# Altium schematic sheet SUP_1V.SchDoc: AMC FMC Carrier v4
size A4; CompanyName: WUT; Organization: WUT ISE; Address1: Warsaw Univeristy of Technology; Address2: Nowowiejska 15/19 00-665 Warsaw; Address3: t.przywozki@gmail.com; Revision: 1; SheetNumber: 14; SheetTotal: 29; Project: AMC FMC Carrier v4; ModifiedBy: -; CreateDate: XX/XX/XXXX; CheckedDate: -; Title2: Power P1V0; DivGrp: ISE; Designer: T. Przywozki; ModifiedDate: -; ProjectName: ADC/DAC MEZZANINE
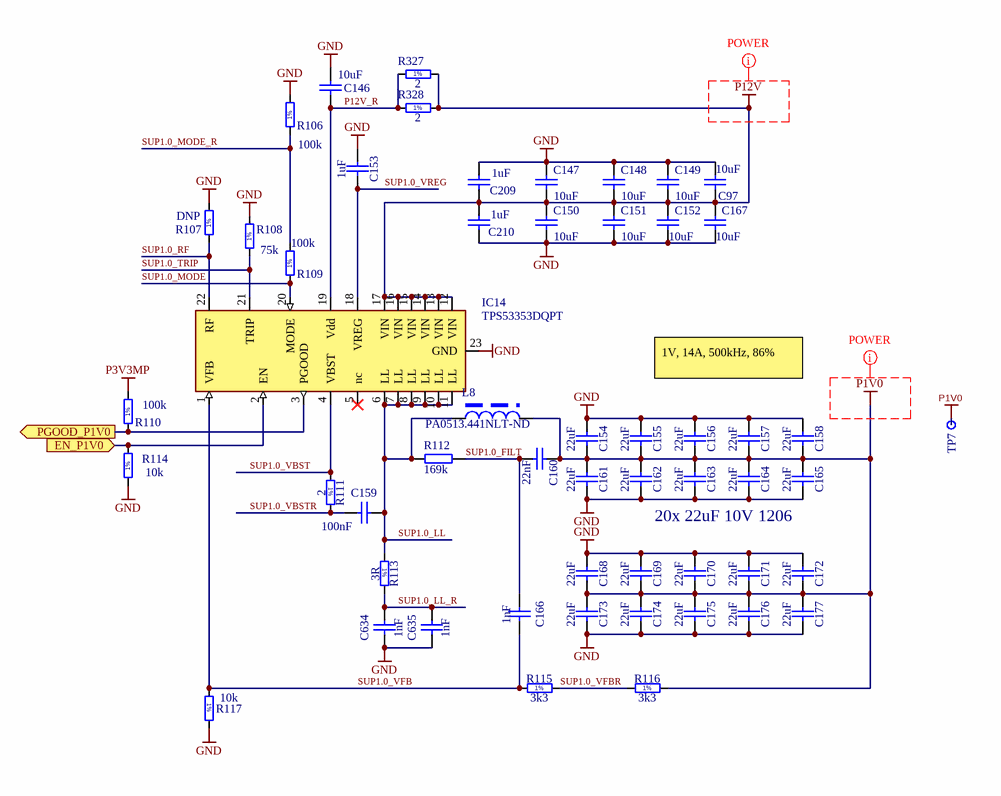
[diagram p0: SUP_1V.SchDoc]

## Parts
C97  10uF  [CAPC2012X135N]
C146  10uF  [CAPC2012X135N]
C147  10uF  [CAPC2012X135N]
C148  10uF  [CAPC2012X135N]
C149  10uF  [CAPC2012X135N]
C150  10uF  [CAPC2012X135N]
C151  10uF  [CAPC2012X135N]
C152  10uF  [CAPC2012X135N]
C153  1uF  [CAPC1608X87N]
C154  22uF  [CAPC3216X180N]
C155  22uF  [CAPC3216X180N]
C156  22uF  [CAPC3216X180N]
C157  22uF  [CAPC3216X180N]
C158  22uF  [CAPC3216X180N]
C159  100nF  [CAPC1005X55N]
C160  22nF  [CAPC1608X87N]
C161  22uF  [CAPC3216X180N]
C162  22uF  [CAPC3216X180N]
C163  22uF  [CAPC3216X180N]
C164  22uF  [CAPC3216X180N]
C165  22uF  [CAPC3216X180N]
C166  1nF  [CAPC1005X55N]
C167  10uF  [CAPC2012X135N]
C168  22uF  [CAPC3216X180N]
C169  22uF  [CAPC3216X180N]
C170  22uF  [CAPC3216X180N]
C171  22uF  [CAPC3216X180N]
C172  22uF  [CAPC3216X180N]
C173  22uF  [CAPC3216X180N]
C174  22uF  [CAPC3216X180N]
C175  22uF  [CAPC3216X180N]
C176  22uF  [CAPC3216X180N]
C177  22uF  [CAPC3216X180N]
C209  1uF  [CAPC1608X87N]
C210  1uF  [CAPC1608X87N]
C634  1nF  [CAPC1005X55N]
C635  1nF  [CAPC1005X55N]
IC14  TPS53353DQPT  [LCCS50P600X500X150-22N]
L8  PA0513.441NLT-ND  [IND_PA0513]
R106  100k  [RESC1005X40N]
R107  DNP  [RESC1608X55N]
R108  75k  [RESC1608X55N]
R109  100k  [RESC1005X40N]
R110  100k  [RESC1005X40N]
R111  2  [RESC1608X55N]
R112  169k  [0603R]
R113  3R  [RESC3216X65N]
R114  10k  [RESC1005X40N]
R115  3k3  [RESC1608X55N]
R116  3k3  [RESC1608X55N]
R117  10k  [RESC1005X40N]
R327  2  [RESC1608X55N]
R328  2  [RESC1608X55N]
TP7  Test Point  [TPS127]  (value not drawn)

## Ports
EN_P1V0 (in), PGOOD_P1V0 (out)

## Nets
GND: C97.1 C146.2 C147.2 C148.2 C149.2 C150.1 C151.1 C152.1 C153.1 C154.1 C155.1 C156.1 C157.1 C158.1 C161.2 C162.2 C163.2 C164.2 C165.2 C167.1 C168.1 C169.1 C170.1 C171.1 C172.1 C173.2 C174.2 C175.2 C176.2 C177.2 C209.2 C210.1 C634.2 C635.2 IC14.23(GND) R106.2 R107.2 R108.2 R114.1 R117.2
P1V0: C154.2 C155.2 C156.2 C157.2 C158.2 C160.2 C161.1 C162.1 C163.1 C164.1 C165.1 C168.2 C169.2 C170.2 C171.2 C172.2 C173.1 C174.1 C175.1 C176.1 C177.1 L8.2 R116.2 TP7.1
P3V3MP: R110.2
P12V: C97.2 C147.1 C148.1 C149.1 C150.2 C151.2 C152.2 C167.2 C209.1 C210.2 IC14.12(VIN) IC14.13(VIN) IC14.14(VIN) IC14.15(VIN) IC14.16(VIN) IC14.17(VIN) R327.2 R328.2
EN_P1V0: IC14.2(EN) R114.2 ; port EN_P1V0
P12V_R: C146.1 IC14.19(Vdd) R327.1 R328.1
PGOOD_P1V0: IC14.3(PGOOD) R110.1 ; port PGOOD_P1V0
SUP1.0_FILT: C160.1 C166.2 R112.1
SUP1.0_LL: C159.1 IC14.6(LL) IC14.7(LL) IC14.8(LL) IC14.9(LL) IC14.10(LL) IC14.11(LL) L8.1 R112.2 R113.1
SUP1.0_LL_R: C634.1 C635.1 R113.2
SUP1.0_MODE: IC14.20(MODE) R109.1
SUP1.0_MODE_R: R106.1 R109.2
SUP1.0_RF: IC14.22(RF) R107.1
SUP1.0_TRIP: IC14.21(TRIP) R108.1
SUP1.0_VBST: IC14.4(VBST) R111.1
SUP1.0_VBSTR: C159.2 R111.2
SUP1.0_VFB: C166.1 IC14.1(VFB) R115.1 R117.1
SUP1.0_VFBR: R115.2 R116.1
SUP1.0_VREG: C153.2 IC14.18(VREG)

Not connected (* = marked no-connect by the designer): IC14 5(nc)*

## Layout directives
net class POWER: P1V0, P12V

## Notes on the sheet
- 1V, 14A, 500kHz, 86%
- 20x 22uF 10V 1206
- Project/Equipment
- Document
- Designer
- Drawn by
- Check.by
- Copyright WUT ISE 2020
  This documentation describes Open Hardware and is licensed under CERN OHL v.1.1. You may redistribute and modify this documentaction under the terms of the CERN OHL v1.1.
  (http://ohwr.org/CERNOHL). This documentation is dristributed WITHOUT ANY EXPRESS OR IMPLIED WARRANTY, INCLUDING OF MERCHANTABLITY, SATISFACTORY QUALITY AND FITNESS FOR A PARTICULAR PURPOSE. Please see the CERN OHL v.1.1 for applicable conditions
- File
- Last Mod.
- Print Date
- Sheet
- Size
- A4
- of
- Rev
- Contact:
- (in symbol R0402_10K_1%_0.0625W_100PPM) 1%
- (in symbol R0402_100K_1%_0.0625W_100PPM) 1%
- (in symbol R0603_2R_1%_0.1W_200PPM) 1%
- (in symbol R0603_3K3_1%_0.1W_100PPM) 1%
- (in symbol R0603_75K_1%_0.1W_100PPM) 1%
- (in symbol R1206_3R_1%_0.25W_200PPM) 1%

## Library data of the parts
C97 C146-C152 C167 = CC0805_10UF_16V_10%_X5R: Non-polarised capacitor; Part Description: SMD Multilayer Chip Ceramic Capacitor; Manufacturer: GENERIC; Manufacturer1 Part Number: C0805C106K4PAC; Voltage: 16V; TC: X5R; Tolerance: ±10%; Table: Capacitors SMD; Part Number: CC0805_10UF_16V_10%_X5R; Component Kind: Standard; Component Type: Standard; Pin Count: 2; Value: 10uF; Status: Preferred; Manufacturer Part Number: CC0805_10UF_16V_10%_X5R; Case: 0805; Mounted: Yes; Socket: No; SMD: Yes; Manufacturer1 Example: KEMET; Manufacturer1 ComponentHeight: 1.4mm; HelpURL: \\cern.ch\dfs\Applications\Altium\Datasheets\CC1206_X5R_KEMET.pdf; Author: CERN DEM JLC; CreateDate: 2007-12-03; LatestRevisionDate: 2007-12-03
C153 C209 C210 = CC0603_1UF_16V_10%_X7R: Non-polarised capacitor; Part Description: SMD Multilayer Chip Ceramic Capacitor; Manufacturer: GENERIC; Manufacturer1 Part Number: 223824613663; Voltage: 16V; TC: X7R; Tolerance: ±10%; Table: Capacitors SMD; Part Number: CC0603_1UF_16V_10%_X7R; Component Kind: Standard; Component Type: Standard; Pin Count: 2; Value: 1uF; Status: Preferred; Manufacturer Part Number: CC0603_1uF_16V_10%_X7R; Case: 0603; Mounted: Yes; Socket: No; SMD: Yes; Manufacturer1 Example: PHYCOMP; Manufacturer1 ComponentHeight: 0.87mm; HelpURL: \\cern.ch\dfs\Applications\Altium\Datasheets\CC0805_X5R_PHYCOMP_HC.pdf; Author: CERN DEM JLC; CreateDate: 2007-12-03; LatestRevisionDate: 2007-12-03
C154-C158 C161-C165 C168-C177 = CC1206_22UF_10V_10%_X7R: Non-polarised capacitor; Part Description: SMD Multilayer Chip Ceramic Capacitor; Manufacturer: GENERIC; Manufacturer1 Part Number: GRM31CR71A226KE15L; Voltage: 10V; TC: X7R; Tolerance: ±10%; Table: Capacitors SMD; Part Number: CC1206_22UF_10V_10%_X7R; Component Kind: Standard; Component Type: Standard; Pin Count: 2; Value: 22uF; Status: Preferred; Manufacturer Part Number: CC1206_22UF_10V_10%_X7R; Case: 1206; Mounted: Yes; Socket: No; SMD: Yes; Manufacturer1 Example: MURATA; Manufacturer1 ComponentHeight: 1.8mm; HelpURL: \\cern.ch\dfs\Applications\Altium\Datasheets\CC1206_X7R_MURATA_GRM-HI-CAP.pdf; Author: CERN DEM JLC; CreateDate: 2010-06-08; LatestRevisionDate: 2010-06-08
C159 = CC0402_100NF_16V_10%_X7R: Non-polarised capacitor; Part Description: SMD Multilayer Chip Ceramic Capacitor; Manufacturer: GENERIC; Manufacturer1 Part Number: 223878715649; Voltage: 16V; TC: X7R; Tolerance: ±10%; Table: Capacitors SMD; Part Number: CC0402_100NF_16V_10%_X7R; Component Kind: Standard; Component Type: Standard; Pin Count: 2; Value: 100nF; Status: Not Recommended; Manufacturer Part Number: CC0402_100NF_16V_10%_X7R; Case: 0402; Mounted: Yes; Socket: No; SMD: Yes; Manufacturer1 Example: PHYCOMP; Manufacturer1 ComponentHeight: 0.55mm; HelpURL: \\cern.ch\dfs\Applications\Altium\Datasheets\CC0402_X7R_PHYCOMP.pdf; Author: CERN DEM JLC; CreateDate: 2007-12-03; LatestRevisionDate: 2007-12-03
C160 = CC0603_22NF_50V_10%_X7R: Non-polarised capacitor; Part Description: SMD Multilayer Chip Ceramic Capacitor; Manufacturer: GENERIC; Manufacturer1 Part Number: 223858615641; Voltage: 50V; TC: X7R; Tolerance: ±10%; Table: Capacitors SMD; Part Number: CC0603_22NF_50V_10%_X7R; Component Kind: Standard; Component Type: Standard; Pin Count: 2; Value: 22nF; Status: Preferred; Manufacturer Part Number: CC0603_22NF_50V_10%_X7R; Case: 0603; Mounted: Yes; Socket: No; SMD: Yes; Manufacturer1 Example: PHYCOMP; Manufacturer1 ComponentHeight: 0.87mm; HelpURL: \\cern.ch\dfs\Applications\Altium\Datasheets\CC0603_X7R_PHYCOMP.pdf; Author: CERN DEM JLC; CreateDate: 2007-12-03; LatestRevisionDate: 2007-12-03
C166 C634 C635 = CC0402_1NF_50V_10%_X7R: Non-polarised capacitor; Part Description: SMD Multilayer Chip Ceramic Capacitor; Manufacturer: GENERIC; Manufacturer1 Part Number: 223858715623; Voltage: 50V; TC: X7R; Tolerance: ±10%; Table: Capacitors SMD; Part Number: CC0402_1NF_50V_10%_X7R; Component Kind: Standard; Component Type: Standard; Pin Count: 2; Value: 1nF; Status: Not Recommended; Manufacturer Part Number: CC0402_1NF_50V_10%_X7R; Case: 0402; Mounted: Yes; Socket: No; SMD: Yes; Manufacturer1 Example: PHYCOMP; Manufacturer1 ComponentHeight: 0.55mm; HelpURL: \\cern.ch\dfs\Applications\Altium\Datasheets\CC0402_X7R_PHYCOMP.pdf; Author: CERN DEM JLC; CreateDate: 2007-12-03; LatestRevisionDate: 2007-12-03
IC14 = PM_TPS53353: High-Efficiency 20-A Synchronous Buck Converter with Eco-mode™; Supplier 1: Digi-Key; Supplier Part Number 1: 296-29490-1-ND
L8 = L_POWER_PA1513_440nH: 440nH, 30A, 0.32mOhm; Supplier 1: Mouser; Supplier Part Number 1: 673-PA0513.441NLT
R106 R109 R110 = R0402_100K_1%_0.0625W_100PPM: Resistor - 1%; Part Description: General Purpose Thick Film Chip Resistor; Manufacturer: GENERIC; Manufacturer1 Part Number: 232270671004L; TC: ±100ppm/°C; Table: Resistors SMD; Part Number: R0402_100K_1%_0.0625W_100PPM; Component Kind: Standard; Component Type: Standard; Pin Count: 2; Value: 100k; Status: Not recommended; Power: 0.0625W; Tolerance: ±1%; Manufacturer Part Number: R0402_100K_1%_0.0625W_100PPM; Case: 0402; Mounted: Yes; Socket: No; SMD: Yes; Manufacturer1 Example: YAGEO PHYCOMP; Manufacturer1 ComponentHeight: 0.4mm; HelpURL: \\cern.ch\dfs\Applications\Altium\Datasheets\R0402_Phycomp_RC0402.pdf; Author: CERN DEM JLC; CreateDate: 2007-12-03; LatestRevisionDate: 2012-10-17
R107 = R0603_75K_1%_0.1W_100PPM: Resistor - 1%; Part Description: General Purpose Thick Film Chip Resistor; Manufacturer: GENERIC; Manufacturer1 Part Number: NRC06F7502TRF; Value: 75k; Power: 0.1W; TC: ±100ppm/°C; Table: Resistors SMD; Part Number: R0603_75K_1%_0.1W_100PPM; Component Kind: Standard; Component Type: Standard; Pin Count: 2; Status: Preferred; Tolerance: ±1%; Manufacturer Part Number: R0603_75K_1%_0.1W_100PPM; Case: 0603; Mounted: Yes; Socket: No; SMD: Yes; Manufacturer1 Example: NIC COMPONENT; Manufacturer1 ComponentHeight: 0.55mm; HelpURL: \\cern.ch\dfs\Applications\Altium\Datasheets\R0603_NIC_NRC.pdf; Author: CERN DEM JLC; CreateDate: 2007-12-03; LatestRevisionDate: 2008-03-13
R108 = R0603_75K_1%_0.1W_100PPM: Resistor - 1%; Part Description: General Purpose Thick Film Chip Resistor; Manufacturer: GENERIC; Manufacturer1 Part Number: NRC06F7502TRF; Power: 0.1W; TC: ±100ppm/°C; Table: Resistors SMD; Part Number: R0603_75K_1%_0.1W_100PPM; Component Kind: Standard; Component Type: Standard; Pin Count: 2; Value: 75k; Status: Preferred; Tolerance: ±1%; Manufacturer Part Number: R0603_75K_1%_0.1W_100PPM; Case: 0603; Mounted: Yes; Socket: No; SMD: Yes; Manufacturer1 Example: NIC COMPONENT; Manufacturer1 ComponentHeight: 0.55mm; HelpURL: \\cern.ch\dfs\Applications\Altium\Datasheets\R0603_NIC_NRC.pdf; Author: CERN DEM JLC; CreateDate: 2007-12-03; LatestRevisionDate: 2008-03-13
R111 R327 R328 = R0603_2R_1%_0.1W_200PPM: Resistor - 1%; Part Description: General Purpose Thick Film Chip Resistor; Manufacturer: GENERIC; Manufacturer1 Part Number: 232270462008L or RC0603FR-072RL; Power: 0.1W; TC: ±200ppm/°C; Table: Resistors SMD; Part Number: R0603_2R_1%_0.1W_200PPM; Component Kind: Standard; Component Type: Standard; Pin Count: 2; Value: 2; Status: Preferred; Tolerance: ±1%; Manufacturer Part Number: R0603_2R_1%_0.1W_200PPM; Case: 0603; Mounted: Yes; Socket: No; SMD: Yes; Manufacturer1 Example: YAGEO PHYCOMP; Manufacturer1 ComponentHeight: 0.65mm; HelpURL: \\cern.ch\dfs\Applications\Altium\Datasheets\R0603_Tyco_RN73.pdf; Author: CERN DEM JLC; CreateDate: 2007-12-03; LatestRevisionDate: 2012-10-17
R112 = RES_0603: SMD Resistor; Supplier 1: Newark; Supplier Part Number 1: 39K0073
R113 = R1206_3R_1%_0.25W_200PPM: Resistor - 1%; Part Description: General Purpose Thick Film Chip Resistor; Manufacturer: GENERIC; Manufacturer1 Part Number: 232272463008; Power: 0.25W; TC: ±200ppm/°C; Table: Resistors SMD; Part Number: R1206_3R_1%_0.25W_200PPM; Component Kind: Standard; Component Type: Standard; Pin Count: 2; Value: 3R; Status: Preferred; Tolerance: ±1%; Manufacturer Part Number: R1206_3R_1%_0.25W_200PPM; Case: 1206; Mounted: Yes; Socket: No; SMD: Yes; Manufacturer1 Example: PHYCOMP; Manufacturer1 ComponentHeight: 0.65mm; HelpURL: \\cern.ch\dfs\Applications\Altium\Datasheets\R1206_Phycomp_RC1206.pdf; Author: CERN DEM JLC; CreateDate: 2007-12-03; LatestRevisionDate: 2009-06-24
R114 R117 = R0402_10K_1%_0.0625W_100PPM: Resistor - 1%; Part Description: General Purpose Thick Film Chip Resistor; Manufacturer: GENERIC; Manufacturer1 Part Number: 232270671003L; TC: ±100ppm/°C; Table: Resistors SMD; Part Number: R0402_10K_1%_0.0625W_100PPM; Component Kind: Standard; Component Type: Standard; Pin Count: 2; Value: 10k; Status: Not recommended; Power: 0.0625W; Tolerance: ±1%; Manufacturer Part Number: R0402_10K_1%_0.0625W_100PPM; Case: 0402; Mounted: Yes; Socket: No; SMD: Yes; Manufacturer1 Example: YAGEO PHYCOMP; Manufacturer1 ComponentHeight: 0.4mm; HelpURL: \\cern.ch\dfs\Applications\Altium\Datasheets\R0402_Phycomp_RC0402.pdf; Author: CERN DEM JLC; CreateDate: 2007-12-03; LatestRevisionDate: 2012-10-17
R115 R116 = R0603_3K3_1%_0.1W_100PPM: Resistor - 1%; Part Description: General Purpose Thick Film Chip Resistor; Manufacturer: GENERIC; Manufacturer1 Part Number: NRC06F3301TRF; Power: 0.1W; TC: ±100ppm/°C; Table: Resistors SMD; Part Number: R0603_3K3_1%_0.1W_100PPM; Component Kind: Standard; Component Type: Standard; Pin Count: 2; Value: 3k3; Status: Preferred; Tolerance: ±1%; Manufacturer Part Number: R0603_3K3_1%_0.1W_100PPM; Case: 0603; Mounted: Yes; Socket: No; SMD: Yes; Manufacturer1 Example: NIC COMPONENT; Manufacturer1 ComponentHeight: 0.55mm; HelpURL: \\cern.ch\dfs\Applications\Altium\Datasheets\R0603_NIC_NRC.pdf; Author: CERN DEM JLC; CreateDate: 2007-12-03; LatestRevisionDate: 2008-03-13
TP7 = SMD_PAD_1.27X1.27MM: Part Description: 1.27mm x 1.27mm PCB Copper Area (SMD Test Point); Mounted: No; Part Number: SMD_PAD_1.27X1.27MM; Component Kind: Standard (No BOM); Component Type: Standard (No BOM); Pin Count: 1; Family: Test Point; Socket: No; SMD: Yes; Sense: No; Status: None; ComponentHeight: 0mm; HelpURL: Undefined; Author: CERN DEM JLC; CreateDate: 12.01.2008; LatestRevisionDate: 12.01.2008; PackageDescription: 1.27mm x 1.27mm PCB Copper Area (SMD Test Point)